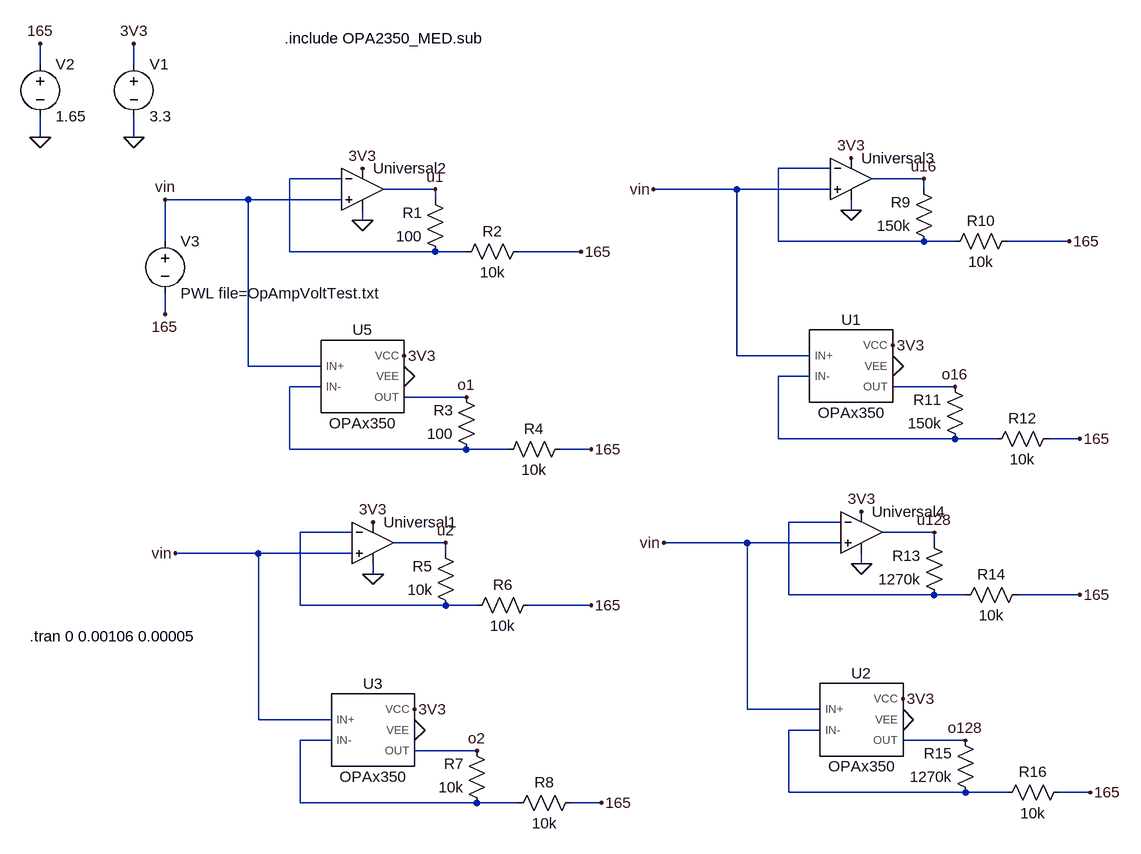
[diagram p0: schematic AmpOps.asc]
AmpOps.asc, the LTspice schematic file:
Version 4.1
SHEET 1 1388 1676
WIRE -288 -48 -288 -80
WIRE -144 -48 -144 -80
WIRE -288 64 -288 32
WIRE -144 64 -144 32
WIRE 928 112 848 112
WIRE 176 128 96 128
WIRE 1072 128 992 128
WIRE 320 144 240 144
WIRE 784 144 656 144
WIRE 928 144 784 144
WIRE 1072 144 1072 128
WIRE 32 160 -96 160
WIRE 176 160 32 160
WIRE 320 160 320 144
WIRE 960 176 960 160
WIRE 208 192 208 176
WIRE -96 224 -96 160
WIRE 848 224 848 112
WIRE 1072 224 848 224
WIRE 1120 224 1072 224
WIRE 1296 224 1200 224
WIRE 96 240 96 128
WIRE 320 240 96 240
WIRE 368 240 320 240
WIRE 544 240 448 240
WIRE -96 336 -96 304
WIRE 784 400 784 144
WIRE 896 400 784 400
WIRE 32 416 32 160
WIRE 144 416 32 416
WIRE 896 432 848 432
WIRE 144 448 96 448
WIRE 1120 448 1024 448
WIRE 368 464 272 464
WIRE 848 528 848 432
WIRE 1120 528 848 528
WIRE 1184 528 1120 528
WIRE 1312 528 1264 528
WIRE 96 544 96 448
WIRE 368 544 96 544
WIRE 432 544 368 544
WIRE 560 544 512 544
WIRE 944 656 864 656
WIRE 192 672 112 672
WIRE 1088 672 1008 672
WIRE 336 688 256 688
WIRE 800 688 672 688
WIRE 944 688 800 688
WIRE 1088 688 1088 672
WIRE 48 704 -80 704
WIRE 192 704 48 704
WIRE 336 704 336 688
WIRE 976 720 976 704
WIRE 224 736 224 720
WIRE 864 768 864 656
WIRE 1088 768 864 768
WIRE 1136 768 1088 768
WIRE 1312 768 1216 768
WIRE 112 784 112 672
WIRE 336 784 112 784
WIRE 384 784 336 784
WIRE 560 784 464 784
WIRE 800 944 800 688
WIRE 912 944 800 944
WIRE 48 960 48 704
WIRE 160 960 48 960
WIRE 912 976 864 976
WIRE 160 992 112 992
WIRE 1136 992 1040 992
WIRE 384 1008 288 1008
WIRE 864 1072 864 976
WIRE 1136 1072 864 1072
WIRE 1200 1072 1136 1072
WIRE 1328 1072 1280 1072
WIRE 112 1088 112 992
WIRE 384 1088 112 1088
WIRE 448 1088 384 1088
WIRE 576 1088 528 1088
FLAG -144 64 0
FLAG -144 -80 3V3
FLAG 208 112 3V3
FLAG 272 400 3V3
FLAG 272 432 0
FLAG 208 192 0
FLAG -288 64 0
FLAG -288 -80 165
FLAG 560 544 165
FLAG 544 240 165
FLAG 224 656 3V3
FLAG 288 944 3V3
FLAG 288 976 0
FLAG 224 736 0
FLAG 576 1088 165
FLAG 560 784 165
FLAG 960 96 3V3
FLAG 1024 384 3V3
FLAG 1024 416 0
FLAG 960 176 0
FLAG 1312 528 165
FLAG 1296 224 165
FLAG 976 640 3V3
FLAG 1040 928 3V3
FLAG 1040 960 0
FLAG 976 720 0
FLAG 1328 1072 165
FLAG 1312 768 165
FLAG -96 336 165
FLAG -96 160 vin
FLAG -80 704 vin
FLAG 672 688 vin
FLAG 656 144 vin
FLAG 320 144 u1
FLAG 336 688 u2
FLAG 1088 672 u128
FLAG 1072 128 u16
FLAG 368 464 o1
FLAG 1120 448 o16
FLAG 1136 992 o128
FLAG 384 1008 o2
SYMBOL OpAmps\\UniversalOpAmp2 208 144 R0
SYMATTR InstName Universal2
SYMBOL voltage -144 -64 R0
WINDOW 123 0 0 Left 0
WINDOW 39 0 0 Left 0
SYMATTR InstName V1
SYMATTR Value 3.3
SYMBOL res 336 256 R180
WINDOW 0 36 76 Left 2
WINDOW 3 36 40 Left 2
SYMATTR InstName R1
SYMATTR Value 100
SYMBOL res 352 256 R270
WINDOW 0 32 56 VTop 2
WINDOW 3 0 56 VBottom 2
SYMATTR InstName R2
SYMATTR Value 10k
SYMBOL res 384 560 R180
WINDOW 0 36 76 Left 2
WINDOW 3 36 40 Left 2
SYMATTR InstName R3
SYMATTR Value 100
SYMBOL res 416 560 R270
WINDOW 0 32 56 VTop 2
WINDOW 3 0 56 VBottom 2
SYMATTR InstName R4
SYMATTR Value 10k
SYMBOL voltage -288 -64 R0
WINDOW 123 0 0 Left 0
WINDOW 39 0 0 Left 0
SYMATTR InstName V2
SYMATTR Value 1.65
SYMBOL voltage -96 208 R0
WINDOW 123 0 0 Left 0
WINDOW 39 0 0 Left 0
SYMATTR InstName V3
SYMATTR Value PWL file=OpAmpVoltTest.txt
SYMBOL OpAmps\\UniversalOpAmp2 224 688 R0
SYMATTR InstName Universal1
SYMBOL res 352 800 R180
WINDOW 0 36 76 Left 2
WINDOW 3 36 40 Left 2
SYMATTR InstName R5
SYMATTR Value 10k
SYMBOL res 368 800 R270
WINDOW 0 32 56 VTop 2
WINDOW 3 0 56 VBottom 2
SYMATTR InstName R6
SYMATTR Value 10k
SYMBOL res 400 1104 R180
WINDOW 0 36 76 Left 2
WINDOW 3 36 40 Left 2
SYMATTR InstName R7
SYMATTR Value 10k
SYMBOL res 432 1104 R270
WINDOW 0 32 56 VTop 2
WINDOW 3 0 56 VBottom 2
SYMATTR InstName R8
SYMATTR Value 10k
SYMBOL OpAmps\\UniversalOpAmp2 960 128 R0
SYMATTR InstName Universal3
SYMBOL res 1088 240 R180
WINDOW 0 36 76 Left 2
WINDOW 3 36 40 Left 2
SYMATTR InstName R9
SYMATTR Value 150k
SYMBOL res 1104 240 R270
WINDOW 0 32 56 VTop 2
WINDOW 3 0 56 VBottom 2
SYMATTR InstName R10
SYMATTR Value 10k
SYMBOL res 1136 544 R180
WINDOW 0 36 76 Left 2
WINDOW 3 36 40 Left 2
SYMATTR InstName R11
SYMATTR Value 150k
SYMBOL res 1168 544 R270
WINDOW 0 32 56 VTop 2
WINDOW 3 0 56 VBottom 2
SYMATTR InstName R12
SYMATTR Value 10k
SYMBOL OpAmps\\UniversalOpAmp2 976 672 R0
SYMATTR InstName Universal4
SYMBOL res 1104 784 R180
WINDOW 0 36 76 Left 2
WINDOW 3 36 40 Left 2
SYMATTR InstName R13
SYMATTR Value 1270k
SYMBOL res 1120 784 R270
WINDOW 0 32 56 VTop 2
WINDOW 3 0 56 VBottom 2
SYMATTR InstName R14
SYMATTR Value 10k
SYMBOL res 1152 1088 R180
WINDOW 0 36 76 Left 2
WINDOW 3 36 40 Left 2
SYMATTR InstName R15
SYMATTR Value 1270k
SYMBOL res 1184 1088 R270
WINDOW 0 32 56 VTop 2
WINDOW 3 0 56 VBottom 2
SYMATTR InstName R16
SYMATTR Value 10k
SYMBOL LTSpiceModels\\sbom071e\\OPAx350 208 432 R0
SYMATTR InstName U5
SYMBOL LTSpiceModels\\sbom071e\\OPAx350 960 416 R0
SYMATTR InstName U1
SYMBOL LTSpiceModels\\sbom071e\\OPAx350 976 960 R0
SYMATTR InstName U2
SYMBOL LTSpiceModels\\sbom071e\\OPAx350 224 976 R0
SYMATTR InstName U3
TEXT 88 -88 Left 2 !.include OPA2350_MED.sub
TEXT -304 832 Left 2 !.tran 0 0.00106 0.00005

The netlist it stands for:
* AmpOps.asc
X§Universal2 vin N002 3V3 0 u1 level2 Avol=1Meg GBW=10Meg Slew=10Meg Ilimit=25m Rail=0 Vos=0 En=0 Enk=0 In=0 Ink=0 Rin=500Meg  ; pins In+ In- V+ V- OUT
V1 3V3 0 3.3
R1 N002 u1 100
R2 N002 165 10k
R3 N004 o1 100
R4 N004 165 10k
V2 165 0 1.65
V3 vin 165 PWL file=OpAmpVoltTest.txt
X§Universal1 vin N006 3V3 0 u2 level2 Avol=1Meg GBW=10Meg Slew=10Meg Ilimit=25m Rail=0 Vos=0 En=0 Enk=0 In=0 Ink=0 Rin=500Meg  ; pins In+ In- V+ V- OUT
R5 N006 u2 10k
R6 N006 165 10k
R7 N008 o2 10k
R8 N008 165 10k
X§Universal3 vin N001 3V3 0 u16 level2 Avol=1Meg GBW=10Meg Slew=10Meg Ilimit=25m Rail=0 Vos=0 En=0 Enk=0 In=0 Ink=0 Rin=500Meg  ; pins In+ In- V+ V- OUT
R9 N001 u16 150k
R10 N001 165 10k
R11 N003 o16 150k
R12 N003 165 10k
X§Universal4 vin N005 3V3 0 u128 level2 Avol=1Meg GBW=10Meg Slew=10Meg Ilimit=25m Rail=0 Vos=0 En=0 Enk=0 In=0 Ink=0 Rin=500Meg  ; pins In+ In- V+ V- OUT
R13 N005 u128 1270k
R14 N005 165 10k
R15 N007 o128 1270k
R16 N007 165 10k
X§U5 vin N004 3V3 0 o1 OPAx350  ; pins IN+ IN- VCC VEE OUT
X§U1 vin N003 3V3 0 o16 OPAx350  ; pins IN+ IN- VCC VEE OUT
X§U2 vin N007 3V3 0 o128 OPAx350  ; pins IN+ IN- VCC VEE OUT
X§U3 vin N008 3V3 0 o2 OPAx350  ; pins IN+ IN- VCC VEE OUT
.include OPA2350_MED.sub
.tran 0 0.00106 0.00005
.lib UniversalOpAmp2.lib
.lib C:\Users\jpulu\OneDrive\Área de Trabalho\TCC\LTSpiceModels\sbom071e\OPAx350.LIB
.backanno
.end